# Altium schematic sheet fire_warning_system.SchDoc
size A4; SheetNumber: 1; SheetTotal: 1
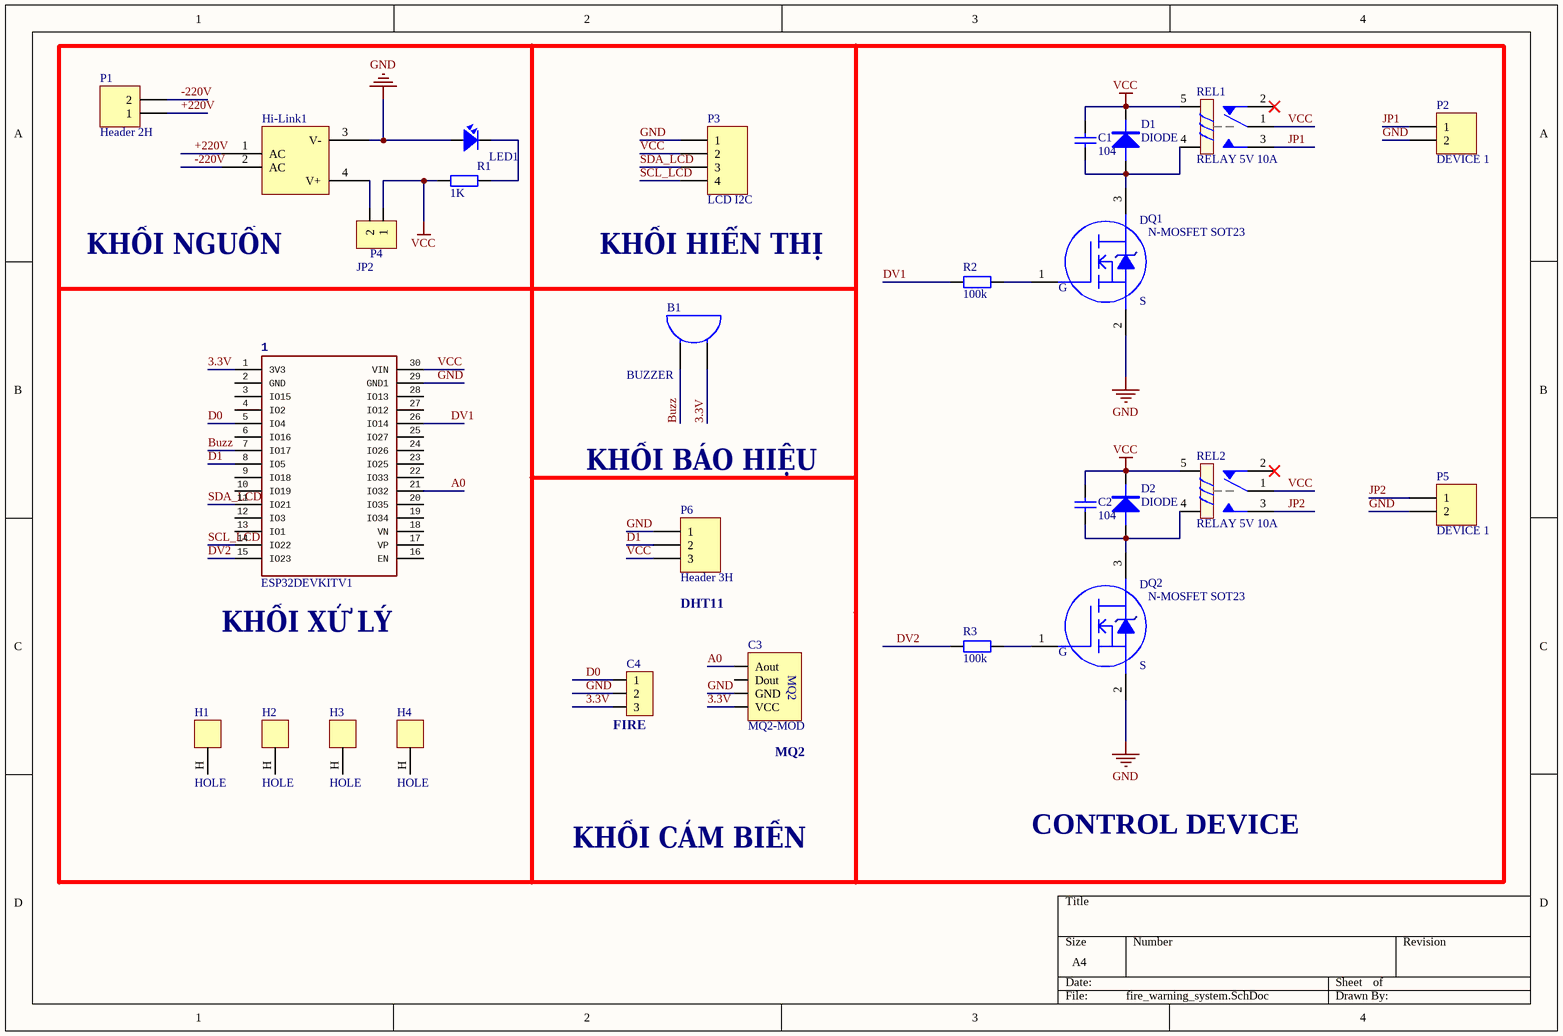
[diagram p0: fire_warning_system.SchDoc]

## Parts
1  ESP32DEVKITV1  [ESP32-DEVKITV1]
B1  BUZZER  [SPEAKER]
C1  104  [0805 CAP]
C2  104  [0805 CAP]
C3  MQ2-MOD  [MQ2-MODULE]
C4  Hồng ngoại  [JP3-C1T]  (value not drawn)
D1  DIODE  [DIODE SMA]
D2  DIODE  [DIODE SMA]
H1  HOLE  [HOLE]
H2  HOLE  [HOLE]
H3  HOLE  [HOLE]
H4  HOLE  [HOLE]
Hi-Link1  Component_1  [5/12V-3W]  (value not drawn)
LED1  LED  [LED SMD 0805]  (value not drawn)
P1  Header 2H  [CON 2KF 5.08MM]
P2  DEVICE 1  [CON 2KF 5.08MM]
P3  LCD I2C  [HDR1X4]
P4  JP2  [JUMPER PITCH 2 PIN]
P5  DEVICE 1  [CON 2KF 5.08MM]
P6  Header 3H  [HDR1X3]
Q1  N-MOSFET SOT23  [TO-92 - 2N7000]
Q2  N-MOSFET SOT23  [TO-92 - 2N7000]
R1  1K  [0805 RESISTOR]
R2  100k  [0805 RESISTOR]
R3  100k  [0805 RESISTOR]
REL1  RELAY 5V 10A  [RELAY 5V-10A]
REL2  RELAY 5V 10A  [RELAY 5V-10A]

## Nets
GND: 1.29(GND1) C3.3(GND) C4.2 Hi-Link1.3(V-) LED1.1 P2.2 P3.1 P5.2 P6.1 Q1.2(S) Q2.2(S)
VCC: 1.30(VIN) C1.1 C2.1 D1.2 D2.2 P3.2 P4.1 P6.3 R1.1 REL1.1 REL1.5 REL2.1 REL2.5
3.3V: 1.1(3V3) B1.2(B) C3.4(VCC) C4.3
+220V: Hi-Link1.1(AC) P1.1
-220V: Hi-Link1.2(AC) P1.2
A0: 1.21(IO32) C3.1(Aout)
Buzz: 1.7(IO17) B1.1(A)
D0: 1.5(IO4) C4.1
D1: 1.8(IO5) P6.2
DV1: 1.26(IO14) R2.2
DV2: 1.15(IO23) R3.2
JP1: P2.1 REL1.3
JP2: P5.1 REL2.3
SCL_LCD: 1.14(IO22) P3.4
SDA_LCD: 1.11(IO21) P3.3
NetC1_2: C1.2 D1.1 Q1.3(D) REL1.4
NetC2_2: C2.2 D2.1 Q2.3(D) REL2.4
NetHi-Link1_4: Hi-Link1.4(V+) P4.2
NetLED1_2: LED1.2 R1.2
NetQ1_1: Q1.1(G) R2.1
NetQ2_1: Q2.1(G) R3.1

Not connected (* = marked no-connect by the designer): 1 2(GND) 3(IO15) 4(IO2) 6(IO16) 9(IO18) 10(IO19) 12(IO3) 13(IO1) 16(EN) 17(VP) 18(VN) 19(IO34) 20(IO35) 22(IO33) 23(IO25) 24(IO26) 25(IO27) 27(IO12) 28(IO13); C3 2(Dout); H1 H(HOLE); H2 H(HOLE); H3 H(HOLE); H4 H(HOLE); REL1 2*; REL2 2*

## Notes on the sheet
- KHỐI NGUỒN
- (near P3) KHỐI HIỂN THỊ
- KHỐI BÁO HIỆU
- (near 1) KHỐI XỬ LÝ
- (near P6) DHT11
- (near C4) FIRE
- (near C3) MQ2
- KHỐI CẢM BIẾN
- CONTROL DEVICE
- (in symbol MQ2-MOD) MQ2

## Library data of the parts
C1 C2 = CAP CERAMIC: Published: 8-Jun-2000; LatestRevisionDate: 17-Jul-2002; LatestRevisionNote: Re-released for DXP Platform.; PackageReference: RAD-0.3; Publisher: Altium Limited
C3 = MQ2-MOD: Manufacturer: W¨¹rth Elektronik eiSos GmbH; partNo: 613004143121; ComponentLink1 Description: Manufacturer; ComponentLink2 Description: Datasheet; NoPins: 04; Created Date: 29 March 2013; ComponentLink1URL: http://www.we-online.com; ComponentLink2URL: http://katalog.we-online.de/em/datasheet/6130xx143121.pdf; Created by: Karrer Zheng
C4 = Header3: Header IDC, 3 x 1 Pin Vertical 2.54mm Pitch (Non-Boxed, Male); Manufacturer: W¨¹rth Elektronik eiSos GmbH; partNo: 613002143121; ComponentLink1 Description: Manufacturer; ComponentLink2 Description: Datasheet; NoPins: 02; Created Date: 29 March 2013; ComponentLink1URL: http://www.we-online.com; ComponentLink2URL: http://katalog.we-online.de/em/datasheet/6130xx143121.pdf; Created by: Karrer Zheng
LED1 = LED: LED Single colour Green and Red; Value: LED 3 ly Single Colour
P2 P5 = Header 2H: LatestRevisionDate: 17-Jul-2002; LatestRevisionNote: Re-released for DXP Platform.; Publisher: Altium Limited
P3 = Header 4H: LatestRevisionDate: 17-Jul-2002; LatestRevisionNote: Re-released for DXP Platform.; Publisher: Altium Limited
P4 = JP2: WR-PHD 2.54 mm Angled Socket Header; Manufacturer: W¨¹rth Elektronik eiSos GmbH; partNo: 613002143121; ComponentLink1 Description: Manufacturer; ComponentLink2 Description: Datasheet; NoPins: 02; Created Date: 29 March 2013; ComponentLink1URL: http://www.we-online.com; ComponentLink2URL: http://katalog.we-online.de/em/datasheet/6130xx143121.pdf; Created by: Karrer Zheng
R1-R3 = RESISTOR: Value: R1/4W - 1K
P1 = Header 2H: LatestRevisionDate: 17-Jul-2002; LatestRevisionNote: Re-released for DXP Platform.; Publisher: Altium Limited
P6 = Header 3H: LatestRevisionDate: 17-Jul-2002; LatestRevisionNote: Re-released for DXP Platform.; Publisher: Altium Limited